# EAGLE design duckiebot_pwm_shield (EAGLE 7.6.0)
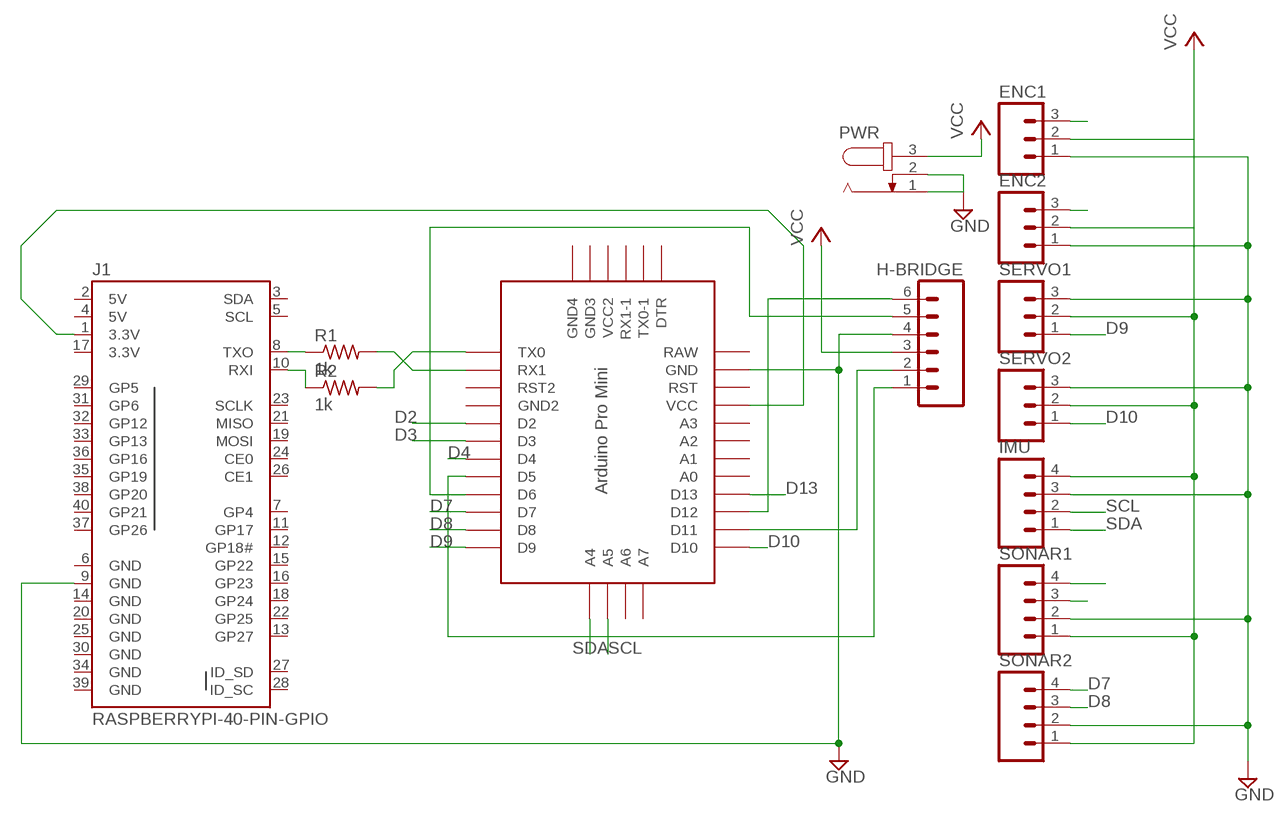
[diagram p0: schematic, sheet 1]

## Parts
ENC1  M03LONGPADS  [1X03_LONGPADS]
ENC2  M03LONGPADS  [1X03_LONGPADS]
H-BRIDGE  M06LONGPADS  [1X06_LONGPADS]
IMU  M04LONGPADS  [1X04_LONGPADS]
J1  RASPBERRYPI-40-PIN-GPIO  [2X20-SHROUDED]
PWR  JACK-PLUG0  [SPC4077]
R1  1k  R-US_0309/10  [0309/10]
R2  1k  R-US_0309/10  [0309/10]
SERVO1  M03LONGPADS  [1X03_LONGPADS]
SERVO2  M03LONGPADS  [1X03_LONGPADS]
SONAR1  M04LONGPADS  [1X04_LONGPADS]
SONAR2  M04LONGPADS  [1X04_LONGPADS]
U$2  PRO-MINI  [PRO-MINI]

## Nets
3.3V: J1.1(3.3V) U$2.VCC
A-1A: H-BRIDGE.2 U$2.D11
A-1B: H-BRIDGE.1 U$2.D5
B-1A: H-BRIDGE.6 U$2.D12
B-1B: H-BRIDGE.5 U$2.D6
D2: ENC1.3 U$2.D2
D3: ENC2.3 U$2.D3
D4: SONAR1.3 U$2.D4
D7: SONAR2.4 U$2.D7
D8: SONAR2.3 U$2.D8
D9: SERVO1.1 U$2.D9
D10: SERVO2.1 U$2.D10
D13: SONAR1.4 U$2.D13
GND: ENC1.1 ENC2.1 H-BRIDGE.4 IMU.3 J1.9(GND) PWR.1 PWR.2 SERVO1.3 SERVO2.3 SONAR1.2 SONAR2.2 U$2.GND
N$1: R1.2 U$2.RX1
N$2: R2.2 U$2.TX0
N$3: J1.10(RXI) R2.1
N$4: J1.8(TXO) R1.1
SCL: IMU.2 U$2.A5
SDA: IMU.1 U$2.A4
VCC: ENC1.2 ENC2.2 H-BRIDGE.3 IMU.4 PWR.3 SERVO1.2 SERVO2.2 SONAR1.1 SONAR2.1
Unconnected: J1.3(SDA) J1.5(SCL) J1.7(GP4) J1.11(GP17) J1.12(GP18#) J1.13(GP27) J1.15(GP22) J1.16(GP23) J1.18(GP24) J1.19(MOSI) J1.21(MISO) J1.22(GP25) J1.23(SCLK) J1.24(CE0) J1.26(CE1) J1.27(ID_SD) J1.28(ID_SC) J1.29(GP5) J1.31(GP6) J1.32(GP12) J1.33(GP13) J1.35(GP19) J1.36(GP16) J1.37(GP26) J1.38(GP20) J1.40(GP21) U$2.A0 U$2.A1 U$2.A2 U$2.A3 U$2.A6 U$2.A7 U$2.DTR U$2.GND1(GND2) U$2.GND2(GND4) U$2.GND3 U$2.RST U$2.RST1(RST2) U$2.RX1-1 U$2.TX0-1 U$2.VCC1(VCC2)

## Power pins joined to a net without a drawn wire
3.3V: J1.17(3.3V)
5V: J1.2(5V) J1.4(5V)
GND: J1.6(GND) J1.14(GND) J1.20(GND) J1.25(GND) J1.30(GND) J1.34(GND) J1.39(GND)
RAW: U$2.RAW

## Library data of the parts
ENC1 ENC2 SERVO1 SERVO2 = SparkFun-Connectors:M03: Header 3 Standard 3-pin 0.1" header. Use with straight break away headers (SKU : PRT-00116), right angle break away headers (PRT-00553), swiss pins (PRT-00743), machine pins (PRT-00117), and female headers (PRT-00115). Molex polarized connector foot print use with SKU : PRT-08232 with associated crimp pins and housings.
H-BRIDGE = SparkFun-Connectors:M06: Header 6 Standard 6-pin 0.1" header. Use with straight break away headers (SKU : PRT-00116), right angle break away headers (PRT-00553), swiss pins (PRT-00743), machine pins (PRT-00117), and female headers (PRT-00115). Molex polarized connector foot print use with SKU : PRT-08094 with associated crimp pins and housings. NOTES ON THE VARIANTS LOCK and LOCK_LONGPADS... This footprint was designed to help hold the alignment of a through-hole component (i.e. 6-pin header) while soldering it into place. You may notice that each hole has been shifted either up or down by 0.005 of an inch from it's more standard position (which is a perfectly straight line). This slight alteration caused the pins (the squares in the middle) to touch the edges of the holes. Because they are alternating, it causes a "brace" to hold the component in place. 0.005 has proven to be the perfect amount of "off-center" position when using our standard breakaway headers. Although looks a little odd when you look at the bare footprint, once you have a header in there, the alteration is very hard to notice. Also,if you push a header all the way into place, it is covered up entirely on the bottom side. This idea of altering the position of holes to aid alignment will be further integrated into the Sparkfun Library for other footprints. It can help hold any component with 3 or more connection pins.
IMU SONAR1 SONAR2 = SparkFun-Connectors:M04: Header 4 Standard 4-pin 0.1" header. Use with straight break away headers (SKU : PRT-00116), right angle break away headers (PRT-00553), swiss pins (PRT-00743), machine pins (PRT-00117), and female headers (PRT-00115). Molex polarized connector foot print use with SKU : PRT-08231 with associated crimp pins and housings. 1MM SMD Version SKU: PRT-10208; PROD_ID: CONN-09696
J1 = SparkFun-Boards:RASPBERRYPI-40-PIN-GPIO: Second Generation Raspberry Pi GPIO Header 2x20 pin connector, as found on B, B+, A+ models.
PWR = con-jack:JACK-PLUG: DC POWER JACK Power Jack, DC, Right Angle, Through Hole, Rated 5A at 16VDC, PC Terminals Distributor: Farnell (www.Farnell.de) Drawing: 84N1161.pdf / 84N1162.pdf Manufacturer: SPC Technology (www.spctechnology.com) Type: SPC4077 / SPC 4078; OC_FARNELL: unknown; OC_NEWARK: unknown
R1 R2 = resistor:R-US_: RESISTOR, American symbol
U$2 = Arduino-clone:PRO-MINI: Arduion Pro Mini Clone V1.0 www.betemcu.cu

## Board
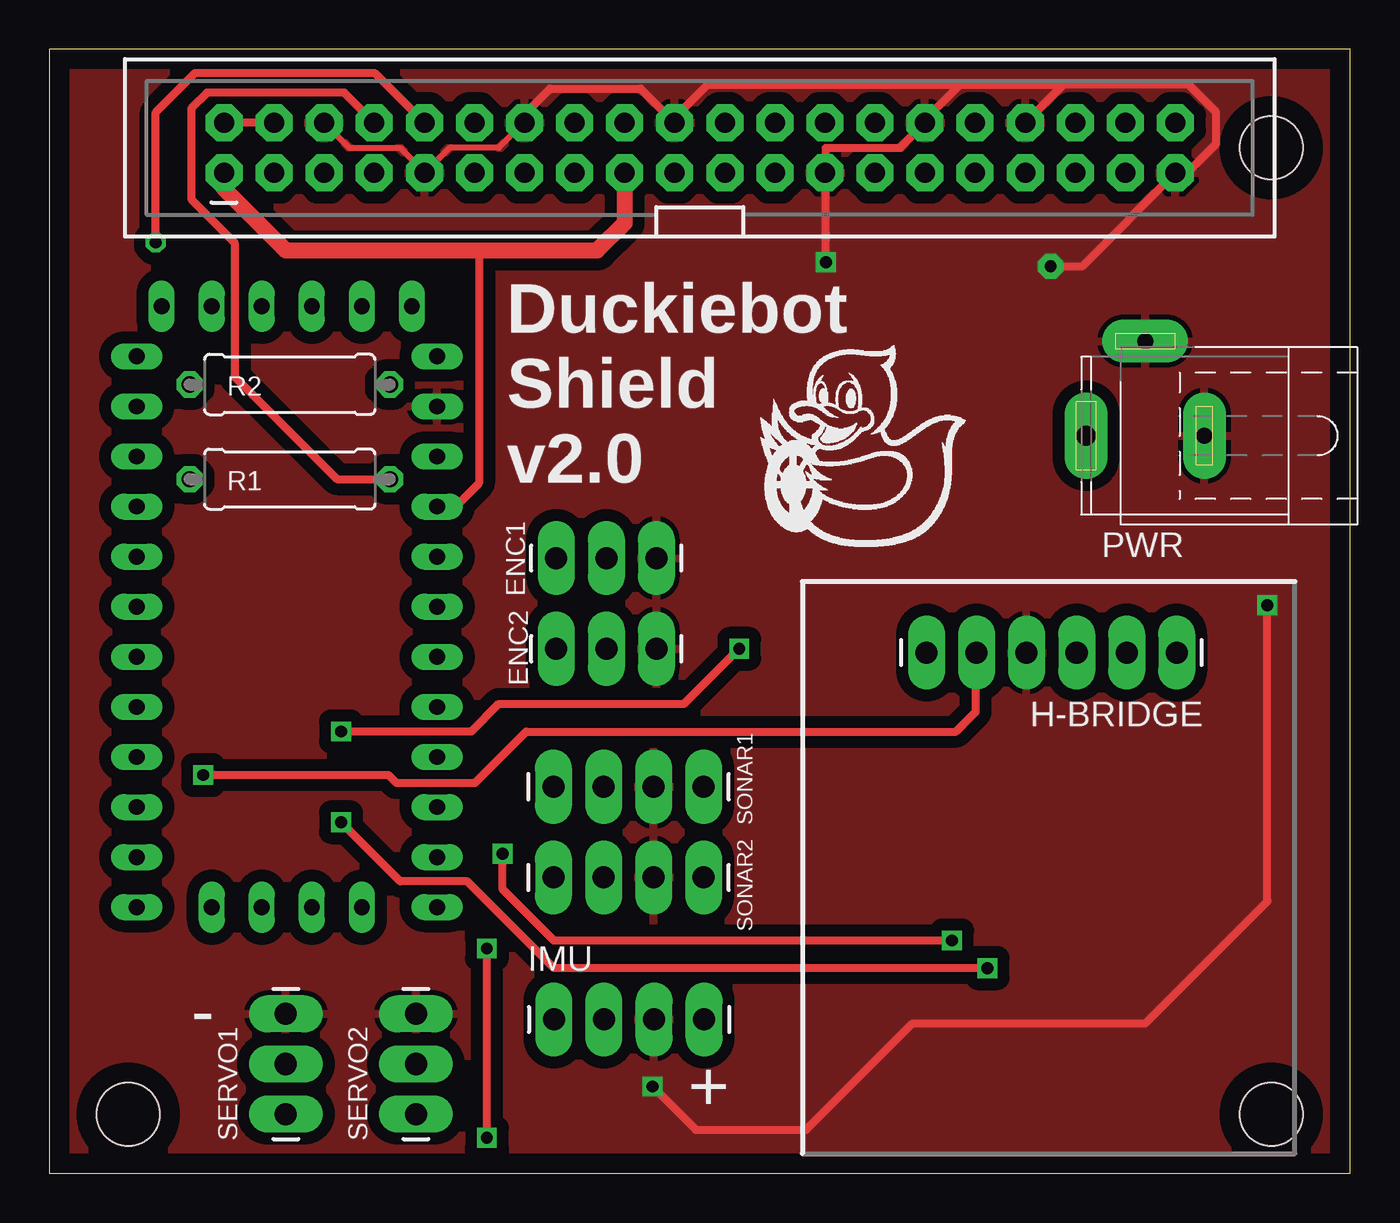
[diagram p1: board, top side]
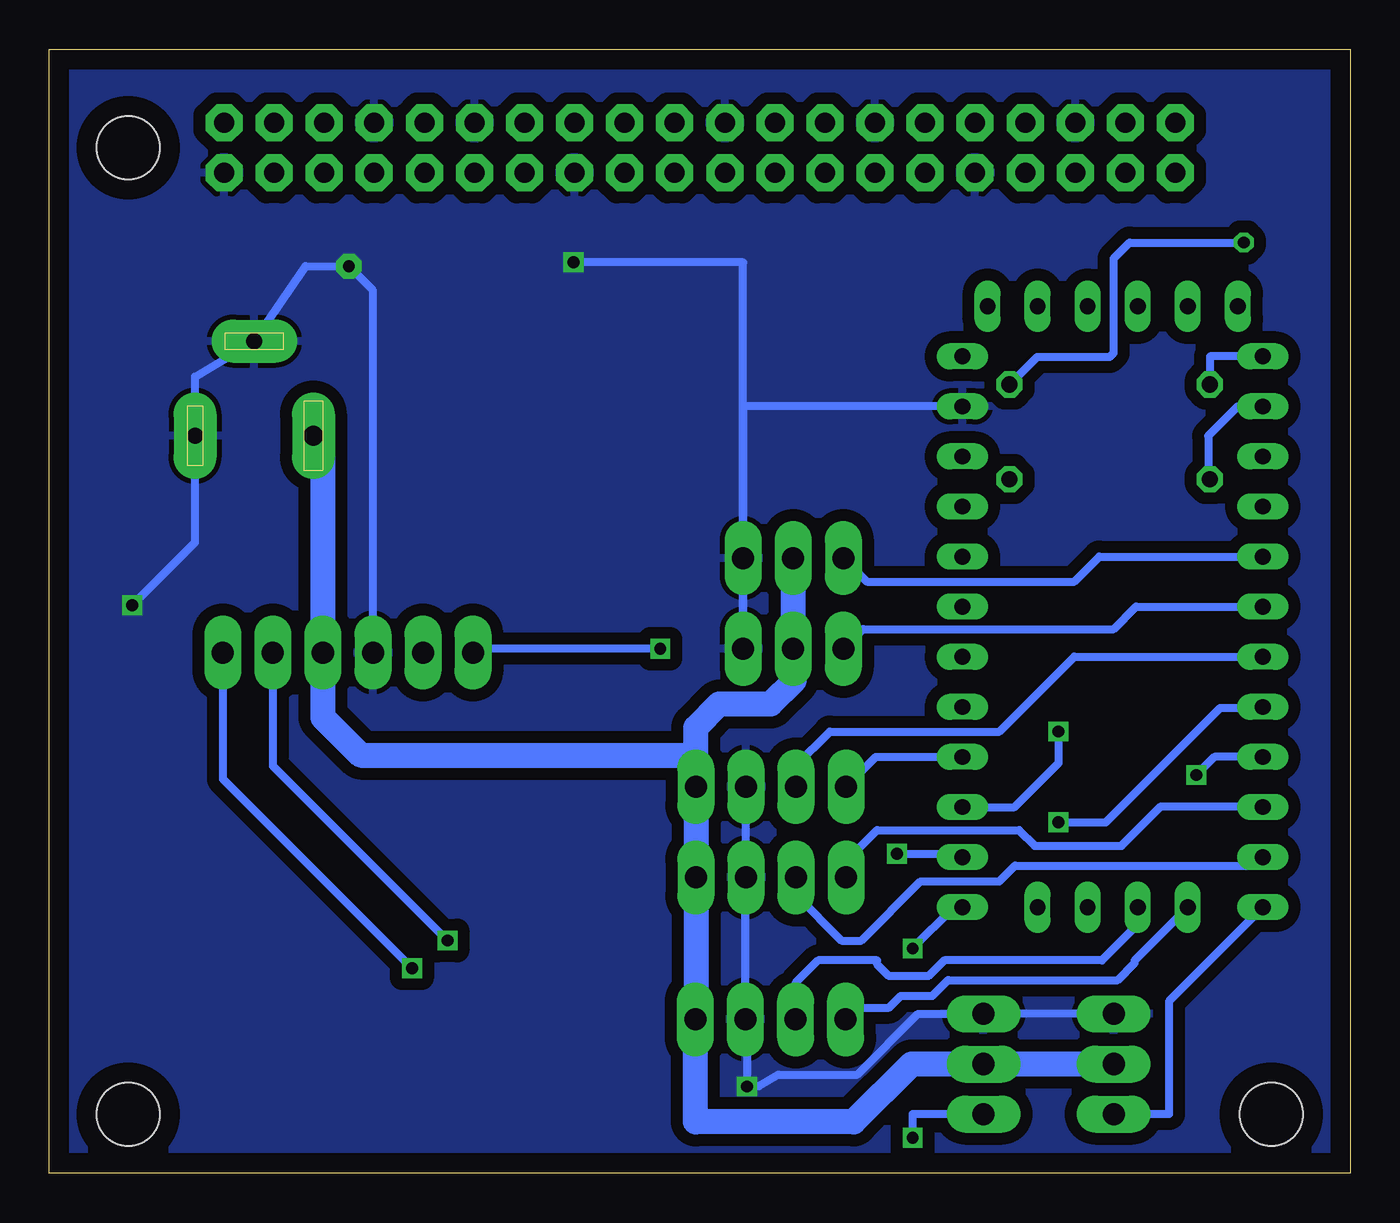
[diagram p2: board, bottom side, seen from below]

Size 66 x 57 mm. Coordinates in mm from the lower left corner, seen from the top.
Outline: 0,0 66,0 66,57 0,57 0,0
Copper layers (1*16): Top 0.035mm / dielectric 1.5mm / Bottom 0.035mm
Design rules "default": minimum track width 10mil, minimum drill 24mil, track to track 8mil, track to pad 8mil, pad to pad 8mil, via to via 8mil, smd to smd 8mil, copper to edge 40mil, drill to drill 8mil, minimum pad ring 10mil, minimum via ring 8mil, stop-mask expansion 4mil, vias tented up to drill 0mil, thermal gap 10mil
Holes 3.2 mm at 4,3 62,3 62,52

### Footprints (pad centres in the part's own frame; a part is rotated, then mirrored left to right if it is on the bottom)
1X03_LONGPADS = drill 1.118 pad 1.88 long: 1 0,0; 2 2.54,0; 3 5.08,0
1X06_LONGPADS = drill 1.118 pad 1.88 long: 1 0,0; 2 2.54,0; 3 5.08,0; 4 7.62,0; 5 10.16,0; 6 12.7,0
1X04_LONGPADS = drill 1.118 pad 1.88 long: 1 0,0; 2 2.54,0; 3 5.08,0; 4 7.62,0
2X20-SHROUDED = drill 1.016 pad 1.88 octagon: 1 -1.27,24.13; 2 1.27,24.13; 3 -1.27,21.59; 4 1.27,21.59; 5 -1.27,19.05; 6 1.27,19.05; 7 -1.27,16.51; 8 1.27,16.51; 9 -1.27,13.97; 10 1.27,13.97; 11 -1.27,11.43; 12 1.27,11.43; 13 -1.27,8.89; 14 1.27,8.89; 15 -1.27,6.35; 16 1.27,6.35; 17 -1.27,3.81; 18 1.27,3.81; 19 -1.27,1.27; 20 1.27,1.27; 21 -1.27,-1.27; 22 1.27,-1.27; 23 -1.27,-3.81; 24 1.27,-3.81; 25 -1.27,-6.35; 26 1.27,-6.35; 27 -1.27,-8.89; 28 1.27,-8.89; 29 -1.27,-11.43; 30 1.27,-11.43; 31 -1.27,-13.97; 32 1.27,-13.97; 33 -1.27,-16.51; 34 1.27,-16.51; 35 -1.27,-19.05; 36 1.27,-19.05; 37 -1.27,-21.59; 38 1.27,-21.59; 39 -1.27,-24.13; 40 1.27,-24.13
SPC4077 = drill 0.8 pad 2.184 long: 1 -3,0; 2 0,-4.8 | drill 1 pad 2.184 long: 3 3,0
0309/10 = drill 0.813 octagon: 1 -5.08,0; 2 5.08,0
PRO-MINI = drill 0.8 long: A0 8.89,8.89; A1 8.89,11.43; A2 8.89,13.97; A3 8.89,16.51; A4 -2.54,-1.27; A5 0,-1.27; A6 2.54,-1.27; A7 5.08,-1.27; D2 -6.35,16.51; D3 -6.35,13.97; D4 -6.35,11.43; D5 -6.35,8.89; D6 -6.35,6.35; D7 -6.35,3.81; D8 -6.35,1.27; D9 -6.35,-1.27; D10 8.89,-1.27; D11 8.89,1.27; D12 8.89,3.81; D13 8.89,6.35; DTR 7.62,29.21; GND 8.89,24.13; GND1 -6.35,19.05; GND2 -5.08,29.21; GND3 -2.54,29.21; RAW 8.89,26.67; RST 8.89,21.59; RST1 -6.35,21.59; RX1 -6.35,24.13; RX1-1 2.54,29.21; TX0 -6.35,26.67; TX0-1 5.08,29.21; VCC 8.89,19.05; VCC1 0,29.21

### Placement (x,y rotation side)
ENC1  30.8,31.2 180 top
ENC2  30.8,26.6 180 top
H-BRIDGE  57.2,26.4 180 top
IMU  25.6,7.8 0 top
J1  33,52 90 top
PWR  55.6,37.4 180 top
R1  12.2,35.2 180 top
R2  12.2,40 180 top
SERVO1  12,3 90 top
SERVO2  18.6,3 90 top
SONAR1  33.2,19.6 180 top
SONAR2  33.2,15 180 top
U$1  [DUCK_LOGO]  36,31.6 0 top
U$2  10.78,14.76 0 top

### Tracks (layer width: path | path; a pad name or v marks a point on that pad's centre or on a via)
3.3V
  Top 0.406: 22,46.8 arc90 21.8,46.6 21.8,35 20.61,33.81 U$2.VCC
  Top 0.813: J1.1 8.87,49.93 12,46.8 22,46.8 27.8,46.8 29.2,48.2 J1.17
5V
  Top 0.406: J1.4 J1.2
A-1A  (via drill 0.6)
  Top 0.406: v45.8,11.8 25.6,11.8 23,14.4 v23,16.2
  Bottom 0.406: H-BRIDGE.2 54.66,20.66 v45.8,11.8 | v23,16.2 19.67,16.2 U$2.D11
A-1B  (via drill 0.6)
  Top 0.406: v47.6,10.4 25.6,10.4 21.2,14.8 17.8,14.8 v14.8,17.8
  Bottom 0.406: H-BRIDGE.1 57.2,20 v47.6,10.4 | v14.8,17.8 12.4,17.8 6.6,23.6 4.48,23.6 U$2.D5
B-1A  (via drill 0.6)
  Top 0.406: v14.8,22.4 21.4,22.4 22.8,23.8 32.2,23.8 v35,26.6
  Bottom 0.406: U$2.D12 17.03,18.57 14.8,20.8 v14.8,22.4 | v35,26.6 44.3,26.6 H-BRIDGE.6
B-1B  (via drill 0.6)
  Top 0.406: v7.8,20.2 17.2,20.2 17.6,19.8 21.6,19.8 24.2,22.4 46,22.4 47,23.4 47,26.36 H-BRIDGE.5
  Bottom 0.406: U$2.D6 6.89,21.11 v7.8,20.2
D2
  Bottom 0.406: ENC1.3 24.52,30 14,30 12.73,31.27 U$2.D2
D3
  Bottom 0.406: ENC2.3 24.72,27.6 12,27.6 10.87,28.73 U$2.D3
D4
  Bottom 0.406: SONAR1.3 28.12,20.68 26.4,22.4 17.8,22.4 14,26.2 U$2.D4
D7
  Bottom 0.406: SONAR2.4 25.58,15.82 24,17.4 16.8,17.4 16,16.6 11.6,16.6 9.6,18.6 4.46,18.6 U$2.D7
D8
  Bottom 0.406: SONAR2.3 28.12,14.12 25.8,11.8 24.8,11.8 21.8,14.8 17.8,14.8 17,15.6 4.86,15.6 U$2.D8
D9
  Bottom 0.406: U$2.D9 9.2,8.72 9.2,3 SERVO1.1
D10  (via drill 0.6)
  Top 0.406: v22.2,1.8 v22.2,11.4
  Bottom 0.406: SERVO2.1 22.2,3 v22.2,1.8 | v22.2,11.4 20.11,13.49 U$2.D10
D13
  Bottom 0.406: SONAR1.4 24.07,21.11 U$2.D13
GND  (via drill 0.6, 0.6 pad 1.27)
  Top 0.305: J1.14 24.07,53.27 22.8,52 20.3,52 J1.9 | J1.6 15.22,52 17.8,52 19.03,50.77
  Top 0.406: v50.8,46 52.4,46 J1.39 57.73,50.73 59.2,52.2 59.2,53.8 57.8,55.2 51.44,55.2 | 51.44,55.2 J1.34 | 46.2,55.2 44.43,53.43 J1.30 43.16,52 39.4,52 39.4,50.73 | 46.2,55.2 51.44,55.2 | J1.14 24.11,53.71 25.4,55 30,55 J1.20 31.73,53.53 33.4,55.2 46.2,55.2 | 19.03,50.77 J1.9 | v39.4,46.2 39.4,50.73 | 39.4,50.73 J1.25 | v30.6,4.4 32.8,2.2 38.4,2.2 43.8,7.6 55.6,7.6 61.8,13.8 v61.8,28.8
  Bottom 0.406: SONAR1.2 SONAR2.2 30.68,14.98 IMU.3 30.68,6.68 30.6,6.6 v30.6,4.4 30,4.4 29,5 25,5 21.92,8.08 SERVO2.3 SERVO1.3 | H-BRIDGE.4 49.58,44.78 v50.8,46 53,46 PWR.2 58.6,40.4 PWR.1 58.6,32 v61.8,28.8 | U$2.GND 30.8,38.89 ENC1.1 ENC2.1 30.8,46.2 v39.4,46.2
  pour Bottom (isolate 0.61): 0,57 0,0 66,0 66,57
  pour Top (isolate 0.61): 0,0 66,0 66,57 0,57
N$1
  Bottom 0.406: U$2.RX1 5.71,38.89 7.2,37.4 7.2,35.28 R1.2
N$2
  Bottom 0.406: U$2.TX0 7.12,41.43 R2.2
N$3  (via drill 0.6)
  Top 0.406: v5.4,47.2 5.4,53.8 7.4,55.8 16.5,55.8 J1.10
  Bottom 0.406: R2.1 15.88,41.4 12.2,41.4 12,41.6 12,46.4 11.2,47.2 v5.4,47.2
N$4
  Top 0.406: J1.8 14.96,54.8 8,54.8 7.2,54 7.2,49.4 9.4,47.2 9.4,40.4 14.6,35.2 R1.1
SCL
  Bottom 0.406: U$2.A5 10.78,12.62 12.6,10.8 20.6,10.8 21.4,10 23.4,10 24,10.6 24,10.8 27,10.8 28.14,9.66 IMU.2
SDA
  Bottom 0.406: U$2.A4 10.93,10.8 10.93,10.67 11.8,9.8 20.4,9.8 21.2,9 22.8,9 23.4,8.4 25.2,8.4 25.6,8 IMU.1
VCC
  Bottom 0.406: 28.2,26.54 ENC2.2 | 33.2,7.82 IMU.4 33.2,7.78 33.2,6.6 | PWR.3 52.12,36.92 | 33.4,21.2 33.2,21.4 | 33.2,2.6 33.22,2.62
  Bottom 1.27: ENC1.2 ENC2.2 | 28.2,26.54 28.2,25 29.4,23.8 32,23.8 33.2,22.6 33.2,21.4 SONAR1.1 SONAR2.1 33.2,7.82 | 52.12,36.92 H-BRIDGE.3 52.12,23.12 50.2,21.2 33.4,21.2 | SERVO1.2 SERVO2.2 22.26,5.54 25.2,2.6 33.2,2.6 | 33.22,2.62 IMU.4

### Text on the board
tNames: Duckiebot / Shield / v2.0 | - | +